# EAGLE design ip_node (EAGLE 5.06)
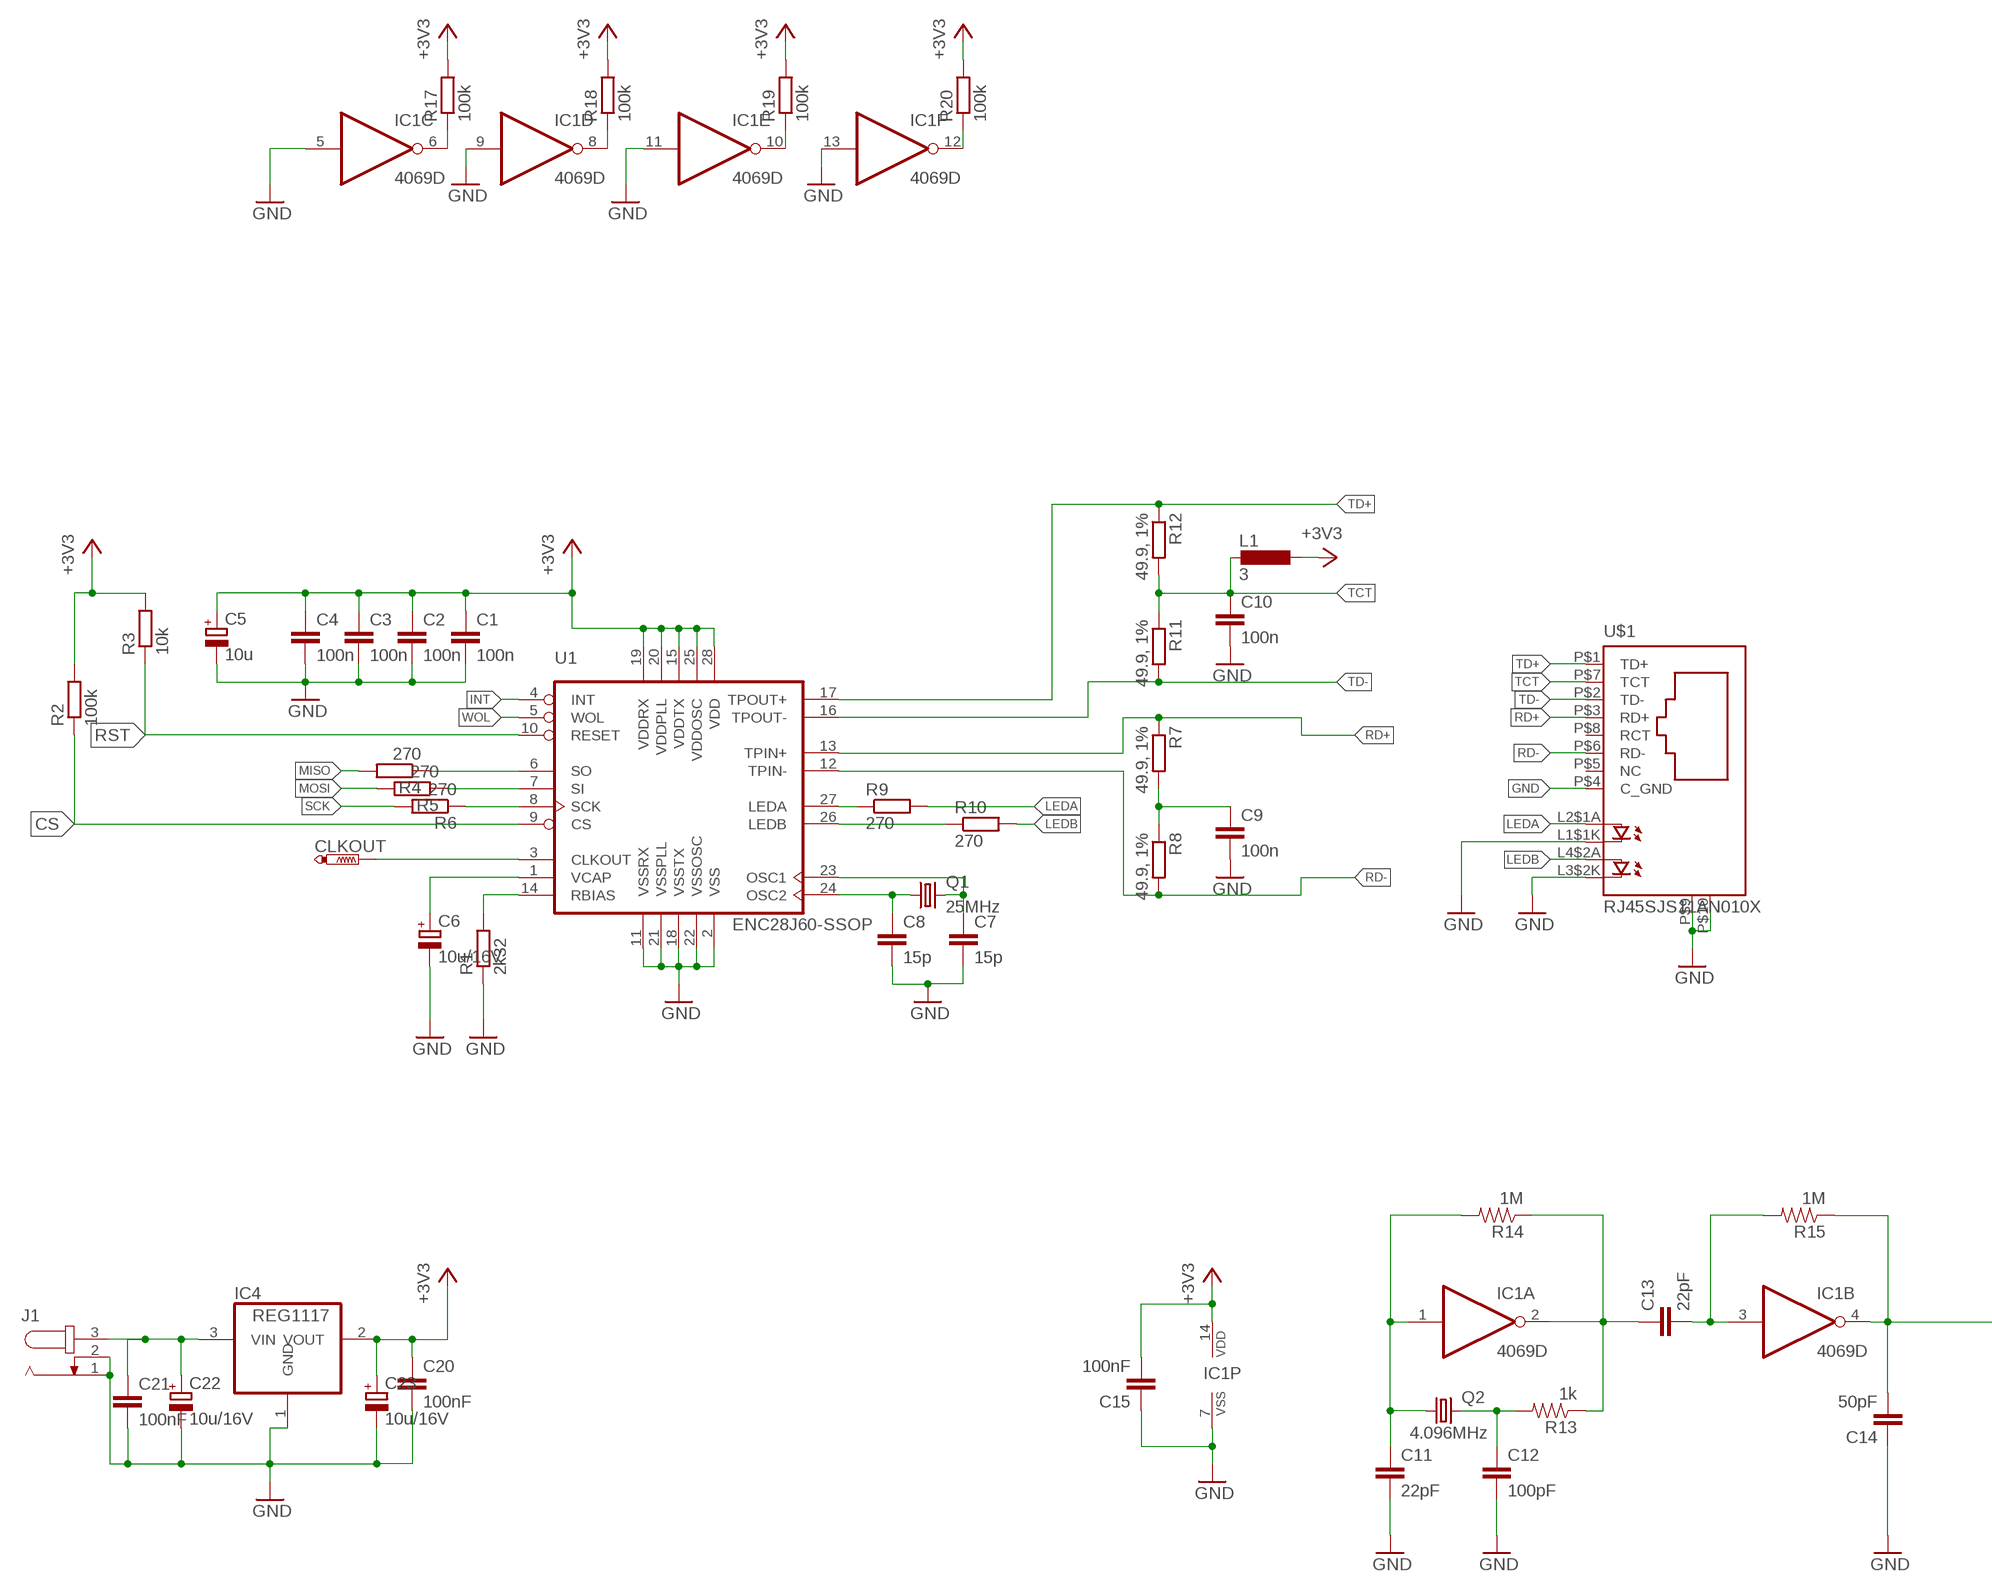
[diagram p0: schematic, sheet 1, part 1 of 2]
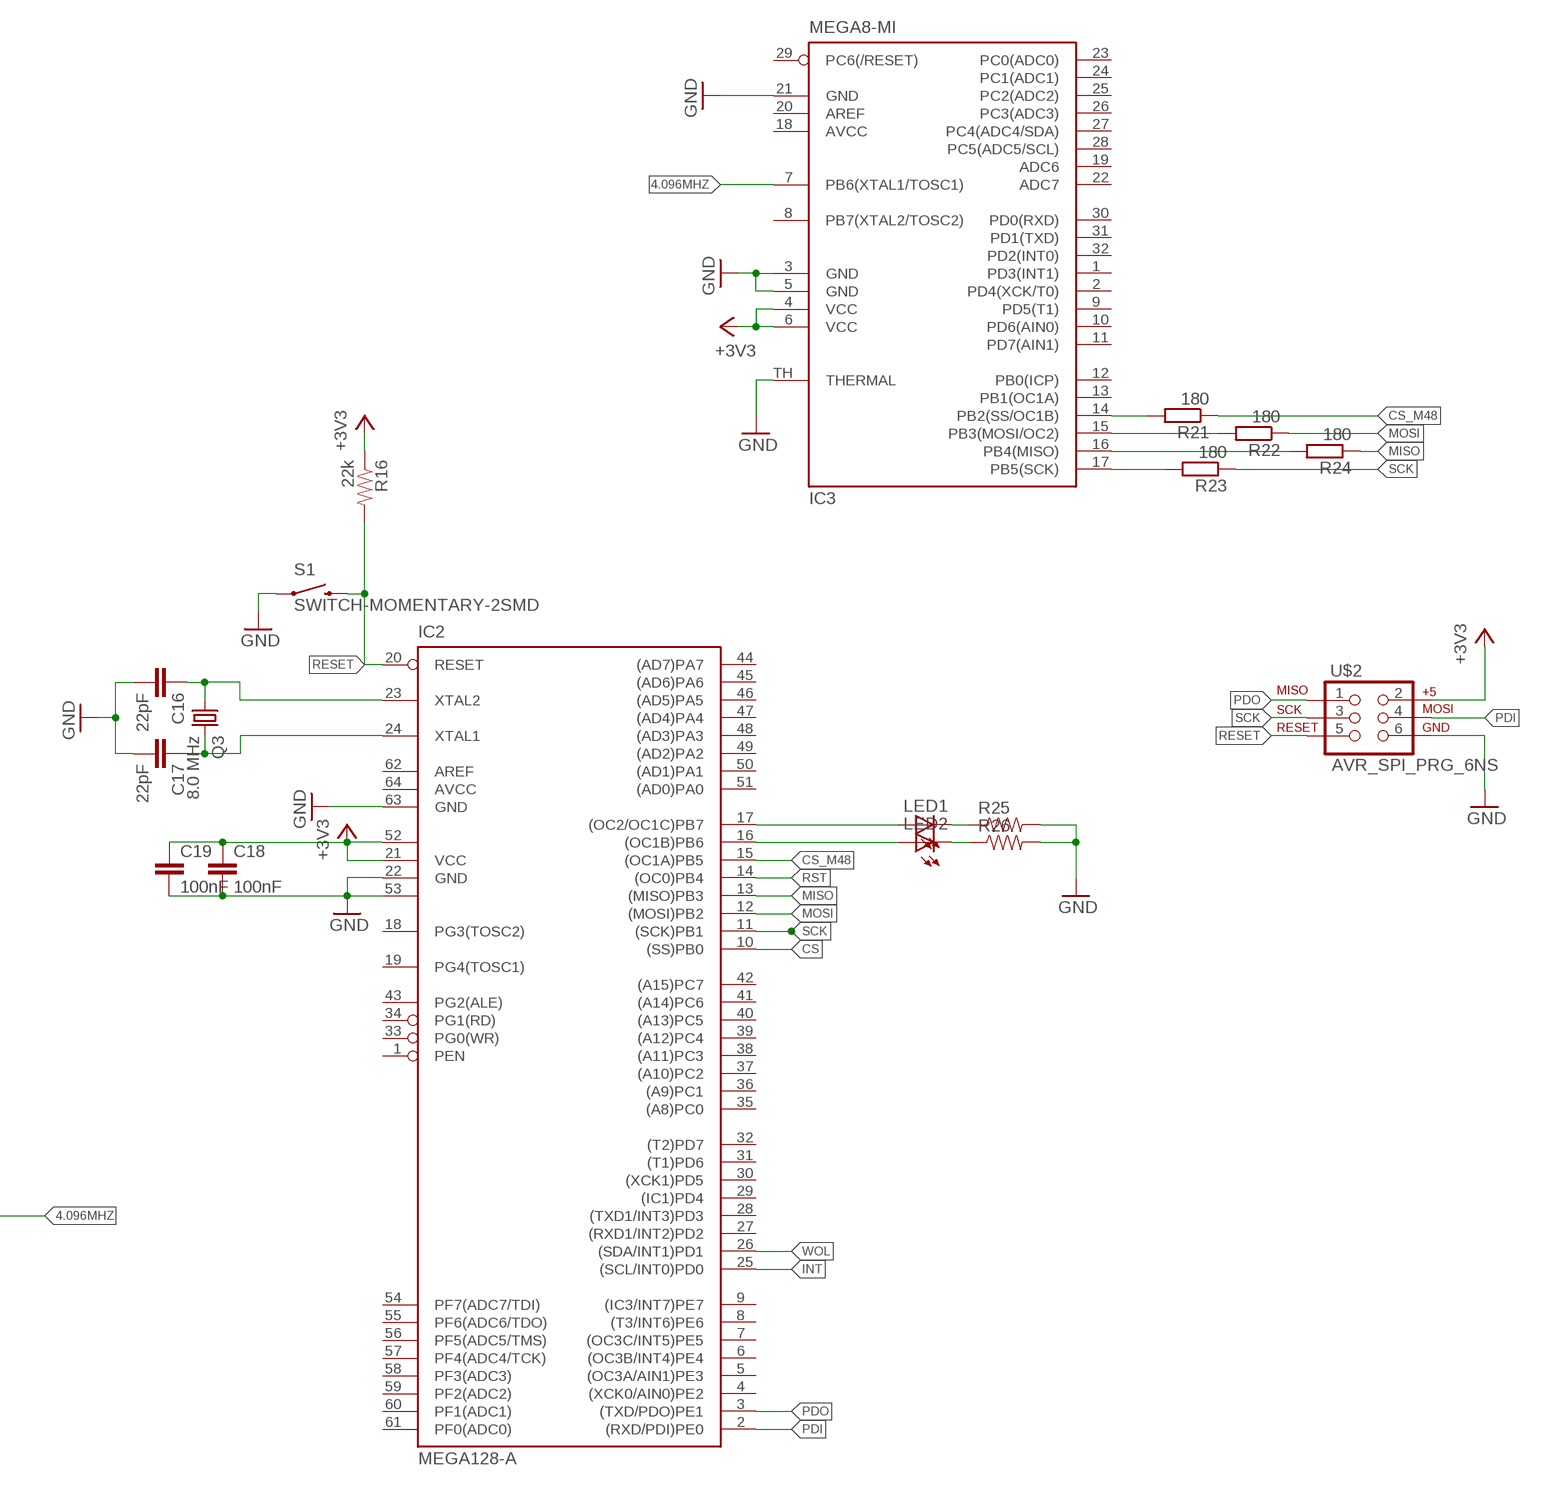
[diagram p1: schematic, sheet 1, part 2 of 2]

## Parts
C1  100n  C-EUC0805  [C0805]
C2  100n  C-EUC0805  [C0805]
C3  100n  C-EUC0805  [C0805]
C4  100n  C-EUC0805  [C0805]
C5  10u  CPOL-EUCT3528  [CT3528]
C6  10u/16V  CPOL-EUCT3528  [CT3528]
C7  15p  C-EUC0805  [C0805]
C8  15p  C-EUC0805  [C0805]
C9  100n  C-EUC0805  [C0805]
C10  100n  C-EUC0805  [C0805]
C11  22pF  CAP0805  [0805]
C12  100pF  CAP0805  [0805]
C13  22pF  CAP0805  [0805]
C14  50pF  CAP0805  [0805]
C15  100nF  CAP0805  [0805]
C16  22pF  CAP0805  [0805]
C17  22pF  CAP0805  [0805]
C18  100nF  CAP0805  [0805]
C19  100nF  CAP0805  [0805]
C20  100nF  CAP0805  [0805]
C21  100nF  CAP0805  [0805]
C22  10u/16V  CPOL-EUCT3528  [CT3528]
C23  10u/16V  CPOL-EUCT3528  [CT3528]
CLKOUT  PTR1B1,27  [B1,27]
IC1  4069D  [SO14]
IC2  MEGA128-A  [TQFP64]
IC3  MEGA8-MI  [MLF32-TH]
IC4  REG1117  [SOT223]
J1  JACK-PLUG0  [SPC4077]
L1  3  L-EU0204/7  [0204/7]
LED1  LED0603  [LED-0603]
LED2  LED0603  [LED-0603]
Q1  25MHz  CRYSTALHC49U70  [HC49U70]
Q2  4.096MHz  CRYSTALHC49UV  [HC49U-V]
Q3  8.0 MHz  CRYSTAL5X3  [CRYSTAL-SMD-5X3]
R1  2k32  R-EU_R0805  [R0805]
R2  100k  R-EU_R0805  [R0805]
R3  10k  R-EU_R0805  [R0805]
R4  270  R-EU_R0805  [R0805]
R5  270  R-EU_R0805  [R0805]
R6  270  R-EU_R0805  [R0805]
R7  49.9, 1%  R-EU_R0805  [R0805]
R8  49.9, 1%  R-EU_R0805  [R0805]
R9  270  R-EU_R0805  [R0805]
R10  270  R-EU_R0805  [R0805]
R11  49.9, 1%  R-EU_R0805  [R0805]
R12  49.9, 1%  R-EU_R0805  [R0805]
R13  1k  RESISTOR  [0805]
R14  1M  RESISTOR  [0805]
R15  1M  RESISTOR  [0805]
R16  22k  RESISTOR  [0805]
R17  100k  R-EU_R0805  [R0805]
R18  100k  R-EU_R0805  [R0805]
R19  100k  R-EU_R0805  [R0805]
R20  100k  R-EU_R0805  [R0805]
R21  180  R-EU_R0805  [R0805]
R22  180  R-EU_R0805  [R0805]
R23  180  R-EU_R0805  [R0805]
R24  180  R-EU_R0805  [R0805]
R25  RESISTOR  [0805]
R26  RESISTOR  [0805]
S1  SWITCH-MOMENTARY-2SMD  [TACTILE_SWITCH_SMD]
U1  ENC28J60-SSOP  [SSOP28]
U$1  RJ45SJS11AN010X  [RJ45SJS11AN010X]
U$2  AVR_SPI_PRG_6NS  [2X3-NS]

## Nets
4.096MHZ: C14.2 IC1.4(B:O) IC3.7(PB6(XTAL1/TOSC1)) R15.1
+3V3: C1.1 C2.1 C3.1 C4.1 C5.+ C15.2 C18.1 C19.1 C20.1 C23.+ IC1.14(P:VDD) IC2.21(VCC) IC2.52(VCC1) IC3.4(VCC) IC3.6(VCC) IC4.2(VOUT) L1.1 R2.2 R3.2 R16.1 R17.2 R18.2 R19.2 R20.2 U1.15(VDDTX) U1.19(VDDRX) U1.20(VDDPLL) U1.25(VDDOSC) U1.28(VDD) U$2.2
CLKOUT: CLKOUT.PP(TP) U1.3(CLKOUT)
CS: IC2.10((SS)PB0) R2.1 U1.9(CS)
CS_M48: IC2.15((OC1A)PB5) R21.1
GND: C1.2 C2.2 C3.2 C4.2 C5.- C6.- C7.2 C8.2 C9.2 C10.2 C11.2 C12.2 C14.1 C15.1 C16.2 C17.2 C18.2 C19.2 C20.2 C21.2 C22.- C23.- IC1.5(C:I) IC1.7(P:VSS) IC1.9(D:I) IC1.11(E:I) IC1.13(F:I) IC2.22(GND) IC2.53(GND1) IC2.63(GND) IC3.3(GND) IC3.5(GND) IC3.21(GND) IC3.TH(THERMAL) IC4.1(GND) J1.1 J1.2 R1.1 R25.2 R26.2 S1.1 U1.2(VSS) U1.11(VSSRX) U1.18(VSSTX) U1.21(VSSPLL) U1.22(VSSOSC) U$1.L1$1K(C) U$1.L3$2K(C1) U$1.P$4(C_GND) U$1.P$9(S1) U$1.P$10(S2) U$2.6
INT: IC2.25((SCL/INT0)PD0) U1.4(INT)
LEDA: R9.2 U$1.L2$1A(A)
LEDB: R10.2 U$1.L4$2A(A1)
MISO: IC2.13((MISO)PB3) R4.2 R24.1
MOSI: IC2.12((MOSI)PB2) R5.2 R22.1
N$1: C11.1 IC1.1(A:I) Q2.1 R14.2
N$2: R6.1 U1.8(SCK)
N$3: R5.1 U1.7(SI)
N$4: R4.1 U1.6(SO)
N$5: C7.1 Q1.2 U1.23(OSC1)
N$6: C8.1 Q1.1 U1.24(OSC2)
N$7: R1.2 U1.14(RBIAS)
N$8: R9.1 U1.27(LEDA)
N$9: R10.1 U1.26(LEDB)
N$10: C12.1 Q2.2 R13.2
N$11: C9.1 R7.2 R8.1
N$12: C13.1 IC1.2(A:O) R13.1 R14.1
N$13: C13.2 IC1.3(B:I) R15.2
N$14: C16.1 IC2.23(XTAL2) Q3.1
N$15: C17.1 IC2.24(XTAL1) Q3.3
N$16: IC1.8(D:O) R18.1
N$17: IC1.10(E:O) R19.1
N$18: IC1.12(F:O) R20.1
N$19: IC1.6(C:O) R17.1
N$20: IC3.17(PB5(SCK)) R23.2
N$21: IC3.16(PB4(MISO)) R24.2
N$22: IC3.15(PB3(MOSI/OC2)) R22.2
N$23: IC3.14(PB2(SS/OC1B)) R21.2
N$24: IC2.17((OC2/OC1C)PB7) LED1.A
N$25: IC2.16((OC1B)PB6) LED2.A
N$26: C21.1 C22.+ IC4.3(VIN) J1.3
N$27: LED1.C R25.1
N$28: LED2.C R26.1
PDI: IC2.2((RXD/PDI)PE0) U$2.4
PDO: IC2.3((TXD/PDO)PE1) U$2.1
RD+: R7.1 U1.13(TPIN+) U$1.P$3(RD+)
RD-: R8.2 U1.12(TPIN-) U$1.P$6(RD-)
RESET: IC2.20(RESET) R16.2 S1.3 U$2.5
RST: IC2.14((OC0)PB4) R3.1 U1.10(RESET)
SCK: IC2.11((SCK)PB1) R6.2 R23.1 U$2.3
TCT: C10.1 L1.2 R11.1 R12.2 U$1.P$7(TCT)
TD+: R12.1 U1.17(TPOUT+) U$1.P$1(TD+)
TD-: R11.2 U1.16(TPOUT-) U$1.P$2(TD-)
VCAP: C6.+ U1.1(VCAP)
WOL: IC2.26((SDA/INT1)PD1) U1.5(WOL)
Unconnected: IC2.1(PEN) IC2.4((XCK0/AIN0)PE2) IC2.5((OC3A/AIN1)PE3) IC2.6((OC3B/INT4)PE4) IC2.7((OC3C/INT5)PE5) IC2.8((T3/INT6)PE6) IC2.9((IC3/INT7)PE7) IC2.18(PG3(TOSC2)) IC2.19(PG4(TOSC1)) IC2.27((RXD1/INT2)PD2) IC2.28((TXD1/INT3)PD3) IC2.29((IC1)PD4) IC2.30((XCK1)PD5) IC2.31((T1)PD6) IC2.32((T2)PD7) IC2.33(PG0(WR)) IC2.34(PG1(RD)) IC2.35((A8)PC0) IC2.36((A9)PC1) IC2.37((A10)PC2) IC2.38((A11)PC3) IC2.39((A12)PC4) IC2.40((A13)PC5) IC2.41((A14)PC6) IC2.42((A15)PC7) IC2.43(PG2(ALE)) IC2.44((AD7)PA7) IC2.45((AD6)PA6) IC2.46((AD5)PA5) IC2.47((AD4)PA4) IC2.48((AD3)PA3) IC2.49((AD2)PA2) IC2.50((AD1)PA1) IC2.51((AD0)PA0) IC2.54(PF7(ADC7/TDI)) IC2.55(PF6(ADC6/TDO)) IC2.56(PF5(ADC5/TMS)) IC2.57(PF4(ADC4/TCK)) IC2.58(PF3(ADC3)) IC2.59(PF2(ADC2)) IC2.60(PF1(ADC1)) IC2.61(PF0(ADC0)) IC2.62(AREF) IC3.1(PD3(INT1)) IC3.2(PD4(XCK/T0)) IC3.8(PB7(XTAL2/TOSC2)) IC3.9(PD5(T1)) IC3.10(PD6(AIN0)) IC3.11(PD7(AIN1)) IC3.12(PB0(ICP)) IC3.13(PB1(OC1A)) IC3.19(ADC6) IC3.20(AREF) IC3.22(ADC7) IC3.23(PC0(ADC0)) IC3.24(PC1(ADC1)) IC3.25(PC2(ADC2)) IC3.26(PC3(ADC3)) IC3.27(PC4(ADC4/SDA)) IC3.28(PC5(ADC5/SCL)) IC3.29(PC6(/RESET)) IC3.30(PD0(RXD)) IC3.31(PD1(TXD)) IC3.32(PD2(INT0)) U$1.P$5(NC) U$1.P$8(RCT)

## Power pins joined to a net without a drawn wire
AVCC: IC2.64(AVCC) IC3.18(AVCC)

## Library data of the parts
C1-C4 C7-C10 = rcl:C-EU: CAPACITOR, European symbol
C5 C6 C22 C23 = rcl:CPOL-EU: POLARIZED CAPACITOR, European symbol
C11-C21 = SparkFun:CAP: Capacitor Standard 0603 ceramic capacitor, and 0.1" leaded capacitor.
CLKOUT = testpad:PTR1: TEST PIN
IC1 = 40xx:4069: Hex INVERTER
IC2 = atmel:MEGA128: MICROCONTROLLER 128 Kbytes FLASH 4 Kbytes SRAM 4 Kbytes EEPROM DUAL USART 8-channel 10 bit ADC Source: avr.lbr
IC3 = atmel:MEGA8-MI: MICROCONTROLLER 8 Kbytes FLASH, 1 kbytes SRAM, 512 bytes EEPROM, USART, 6-channel 10 bit ADC, 2-channel 8 bit ADC Pin compatible with Atmega48, ATMega88, ATMega168 Source: avr.lbr
IC4 = burr-brown:REG1117: 800mA and 1A Low Dropout (LDO) Positive Regulator 1.8V, 2.5V, 2.85V, 3.3V, 5V, and Adj
J1 = con-jack:JACK-PLUG: DC POWER JACK Power Jack, DC, Right Angle, Through Hole, Rated 5A at 16VDC, PC Terminals Distributor: Farnell (www.Farnell.de) Drawing: 84N1161.pdf / 84N1162.pdf Manufacturer: SPC Technology (www.spctechnology.com) Type: SPC4077 / SPC 4078
L1 = rcl:L-EU: INDUCTOR, European symbol
LED1 LED2 = SparkFun:LED: LEDs Standard schematic elements and footprints for 5mm, 3mm, 1206, and 0603 sized LEDs. 5mm - Spark Fun Electronics SKU : COM-00529 (and others)
Q1 = crystal:CRYSTAL: CRYSTAL
Q2 Q3 = SparkFun:CRYSTAL: Crystals Various standard crystals. Proven footprints. Spark Fun Electronics SKU : COM-00534
R1-R12 R17-R24 = rcl:R-EU_: RESISTOR, European symbol
R13-R16 R25 R26 = SparkFun:RESISTOR: Resistor Basic schematic elements and footprints for 0603, 1206, and PTH 1/10th watt (small) resistors.
S1 = SparkFun:SWITCH-MOMENTARY-2
U1 = microchip-enc28j60:ENC28J60-*: Microchip 10Mbit Eth. contoller with SPI interface
U$1 = rj45:RJ45SJS11AN010X
U$2 = SparkFun:AVR_SPI_PRG_6: AVR ISP 6 Pin This is the reduced ISP connector for AVR programming. Common on Arduino. This footprint will take up less PCB space and can be used with a 10-pin to 6-pin adapter such as SKU: BOB-08508

## Board
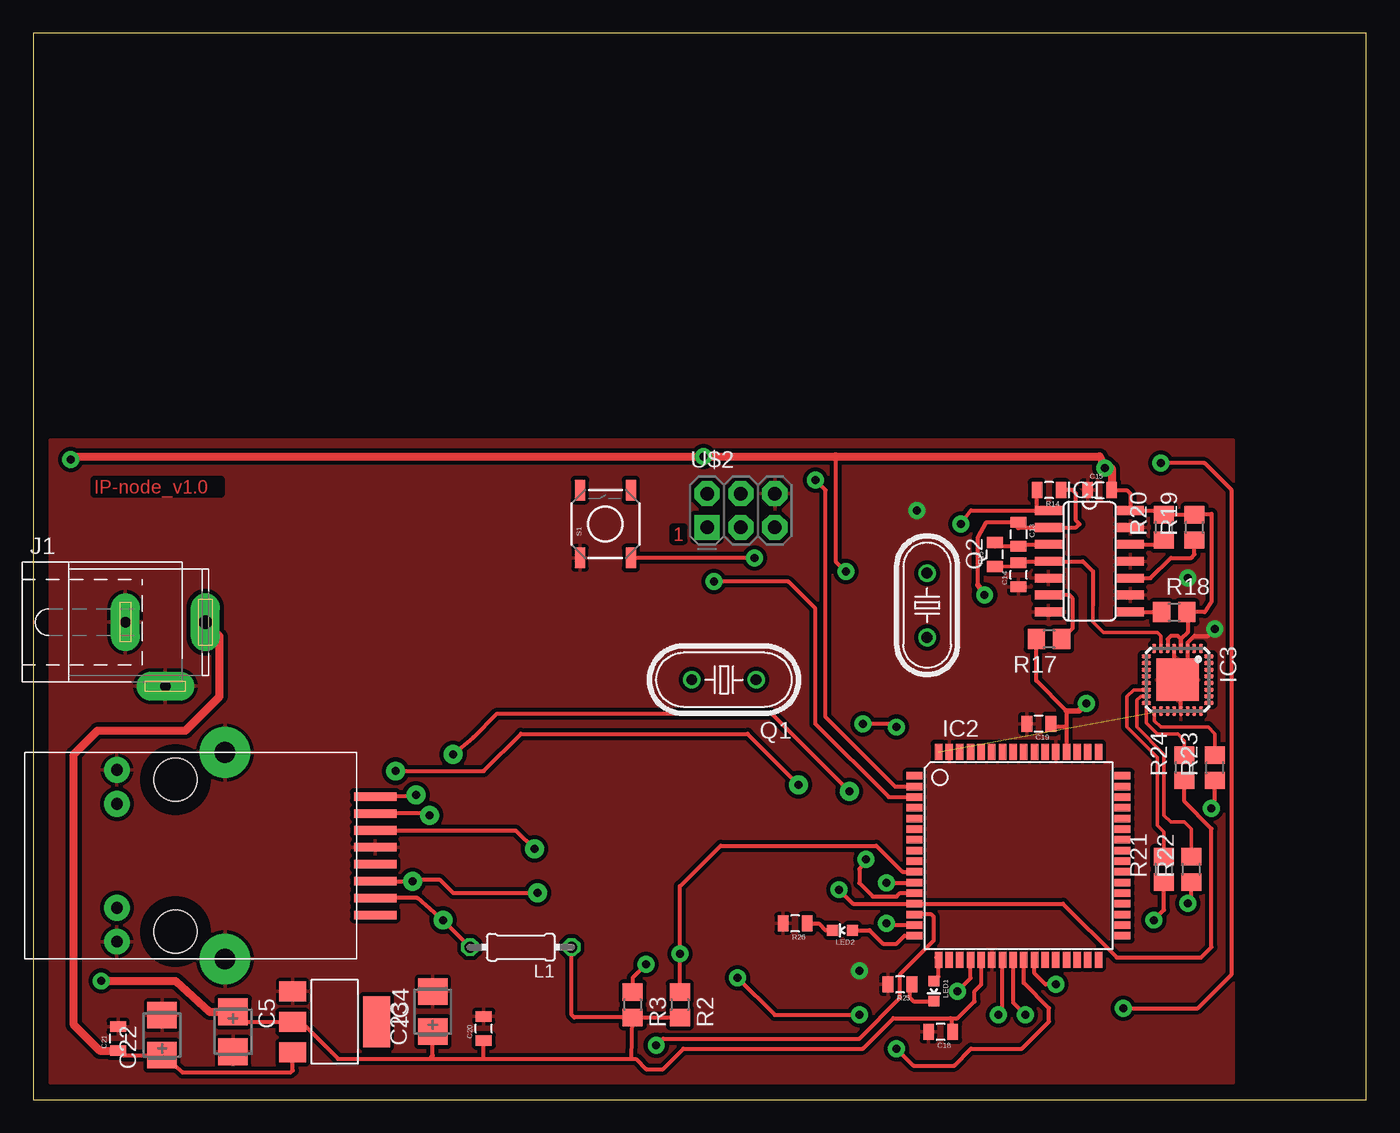
[diagram p2: board, top side]
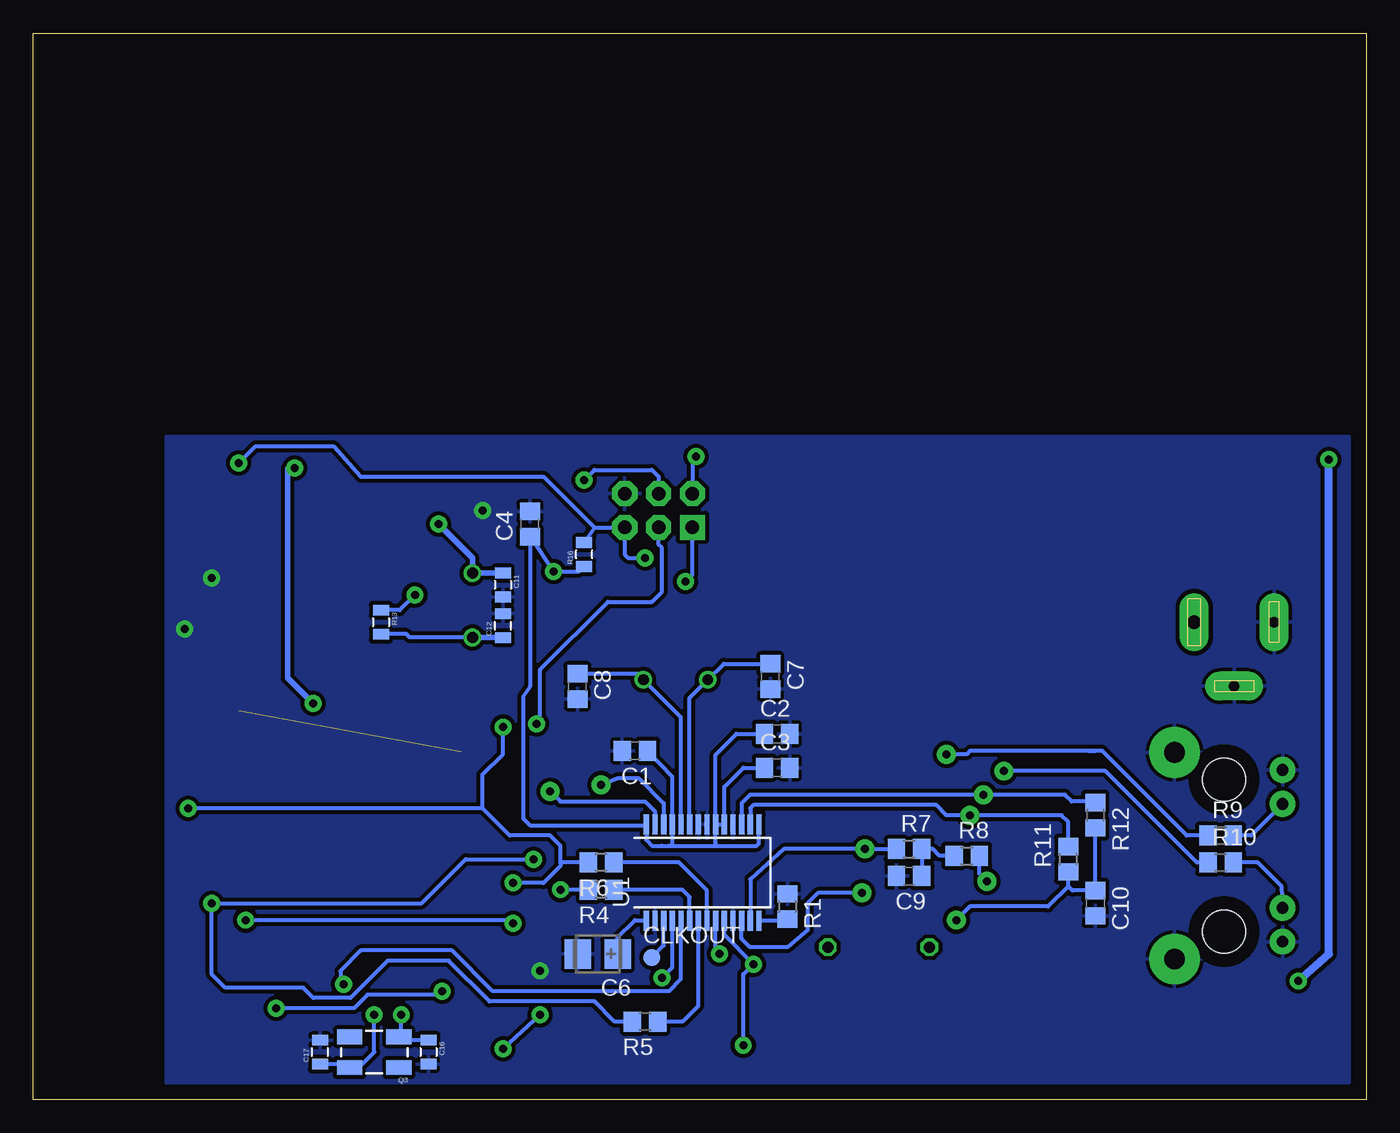
[diagram p3: board, bottom side, seen from below]

Size 100 x 80 mm. Coordinates in mm from the lower left corner, seen from the top.
Outline: 0,0 100,0 100,80 0,80 0,0
Copper layers (1*16): Top 0.035mm / dielectric 1.5mm / Bottom 0.035mm
Design rules "default *": minimum track width 10mil, minimum drill 0.6mm, track to track 8mil, track to pad 8mil, pad to pad 8mil, via to via 8mil, smd to smd 8mil, copper to edge 40mil, drill to drill 8mil, minimum pad ring 10mil, minimum via ring 8mil, stop-mask expansion 4mil, vias tented up to drill 0mil, thermal gap 10mil

### Footprints (pad centres in the part's own frame; a part is rotated, then mirrored left to right if it is on the bottom)
C0805 = smd 1.3 x 1.5: 1 -0.95,0; 2 0.95,0
CT3528 = smd 2 x 2.2: + -1.5,0; - 1.5,0
0805 = smd 0.8 x 1.2: 1 -0.9,0; 2 0.9,0
B1,27 = smd 1.27 x 1.27: PP 0,0
SO14 = smd 0.66 x 2.032: 1 -3.81,-3.073; 2 -2.54,-3.073; 3 -1.27,-3.073; 4 0,-3.073; 5 1.27,-3.073; 6 2.54,-3.073; 7 3.81,-3.073; 8 3.81,3.073; 9 2.54,3.073; 10 1.27,3.073; 11 0,3.073; 12 -1.27,3.073; 13 -2.54,3.073; 14 -3.81,3.073
TQFP64 = smd 1.194 x 0.559: 1 -7.8,6; 2 -7.8,5.2; 3 -7.8,4.4; 4 -7.8,3.6; 5 -7.8,2.8; 6 -7.8,2; 7 -7.8,1.2; 8 -7.8,0.4; 9 -7.8,-0.4; 10 -7.8,-1.2; 11 -7.8,-2; 12 -7.8,-2.8; 13 -7.8,-3.6; 14 -7.8,-4.4; 15 -7.8,-5.2; 16 -7.8,-6; 33 7.8,-6; 34 7.8,-5.2; 35 7.8,-4.4; 36 7.8,-3.6; 37 7.8,-2.8; 38 7.8,-2; 39 7.8,-1.2; 40 7.8,-0.4; 41 7.8,0.4; 42 7.8,1.2; 43 7.8,2; 44 7.8,2.8; 45 7.8,3.6; 46 7.8,4.4; 47 7.8,5.2; 48 7.8,6 | smd 0.559 x 1.194: 17 -6,-7.8; 18 -5.2,-7.8; 19 -4.4,-7.8; 20 -3.6,-7.8; 21 -2.8,-7.8; 22 -2,-7.8; 23 -1.2,-7.8; 24 -0.4,-7.8; 25 0.4,-7.8; 26 1.2,-7.8; 27 2,-7.8; 28 2.8,-7.8; 29 3.6,-7.8; 30 4.4,-7.8; 31 5.2,-7.8; 32 6,-7.8; 49 6,7.8; 50 5.2,7.8; 51 4.4,7.8; 52 3.6,7.8; 53 2.8,7.8; 54 2,7.8; 55 1.2,7.8; 56 0.4,7.8; 57 -0.4,7.8; 58 -1.2,7.8; 59 -2,7.8; 60 -2.8,7.8; 61 -3.6,7.8; 62 -4.4,7.8; 63 -5.2,7.8; 64 -6,7.8
MLF32-TH = smd 0.7 x 0.3: 1 -2.35,1.75; 2 -2.35,1.25; 3 -2.35,0.75; 4 -2.35,0.25; 5 -2.35,-0.25; 6 -2.35,-0.75; 7 -2.35,-1.25; 8 -2.35,-1.75; 17 2.35,-1.75; 18 2.35,-1.25; 19 2.35,-0.75; 20 2.35,-0.25; 21 2.35,0.25; 22 2.35,0.75; 23 2.35,1.25; 24 2.35,1.75 | smd 0.3 x 0.7: 9 -1.75,-2.35; 10 -1.25,-2.35; 11 -0.75,-2.35; 12 -0.25,-2.35; 13 0.25,-2.35; 14 0.75,-2.35; 15 1.25,-2.35; 16 1.75,-2.35; 25 1.75,2.35; 26 1.25,2.35; 27 0.75,2.35; 28 0.25,2.35; 29 -0.25,2.35; 30 -0.75,2.35; 31 -1.25,2.35; 32 -1.75,2.35 | smd 3.2 x 3.2: TH 0,0
SOT223 = smd 1.499 x 2.007: 1 -2.261,-3.15; 2 0.025,-3.15; 3 2.311,-3.15 | smd 3.81 x 2.007: 4 0,3.15
SPC4077 = drill 0.8 pad 2.184 long: 1 -3,0; 2 0,-4.8 | drill 1 pad 2.184 long: 3 3,0
0204/7 = drill 0.813 octagon: 1 -3.81,0; 2 3.81,0
LED-0603 = smd 0.8 x 0.8: A 0,-0.75; C 0,0.75
HC49U70 = drill 0.813 round: 1 -2.413,0; 2 2.413,0
HC49U-V = drill 0.813 round: 1 -2.413,0; 2 2.413,0
CRYSTAL-SMD-5X3 = smd 1.9 x 1.1: 1 -1.85,-1.15; 2 1.85,-1.15; 3 1.85,1.15; 4 -1.85,1.15
R0805 = smd 1.3 x 1.5: 1 -0.95,0; 2 0.95,0
TACTILE_SWITCH_SMD = smd 1.524 x 0.762: 1 -2.54,1.905; 2 2.54,1.905; 3 -2.54,-1.905; 4 2.54,-1.905
SSOP28 = smd 0.4 x 1.5: 1 -4.225,-3.625; 2 -3.575,-3.625; 3 -2.925,-3.625; 4 -2.275,-3.625; 5 -1.625,-3.625; 6 -0.975,-3.625; 7 -0.325,-3.625; 8 0.325,-3.625; 9 0.975,-3.625; 10 1.625,-3.625; 11 2.275,-3.625; 12 2.925,-3.625; 13 3.575,-3.625; 14 4.225,-3.625; 15 4.225,3.625; 16 3.575,3.625; 17 2.925,3.625; 18 2.275,3.625; 19 1.625,3.625; 20 0.975,3.625; 21 0.325,3.625; 22 -0.325,3.625; 23 -0.975,3.625; 24 -1.625,3.625; 25 -2.275,3.625; 26 -2.925,3.625; 27 -3.575,3.625; 28 -4.225,3.625
RJ45SJS11AN010X = drill 0.89 pad 1.93 round: L1$1K 6.44,19.38; L2$1A 3.9,19.38; L3$2K -6.44,19.38; L4$2A -3.9,19.38 | smd 0.64 x 3.18: P$1 4.445,0; P$2 3.175,0; P$3 1.905,0; P$4 0.635,0; P$5 -0.635,0; P$6 -1.905,0; P$7 -3.175,0; P$8 -4.445,0 | drill 1.57 pad 3.81 round: P$9 -7.75,11.278; P$10 7.75,11.278 | hole 3.25: -5.7,14.988; 5.7,14.988
2X3-NS = drill 1.016 pad 1.88 square: 1 -2.54,-1.27 | drill 1.016 pad 1.88 octagon: 2 -2.54,1.27; 3 0,-1.27; 4 0,1.27; 5 2.54,-1.27; 6 2.54,1.27

### Placement (x,y rotation side)
C1  54.86,26.16 180 bottom
C2  44.2,27.43 0 bottom
C3  44.2,24.89 0 bottom
C4  62.74,43.18 90 bottom
C5  14.99,5.08 270 top
C6  57.66,10.92 180 bottom
C7  44.7,31.75 270 bottom
C8  59.18,30.99 270 bottom
C9  34.29,16.76 180 bottom
C10  20.32,14.73 270 bottom
C11  64.77,38.61 270 bottom
C12  64.77,35.56 90 bottom
C13  73.91,42.42 270 top
C14  73.91,39.37 90 top
C15  80.01,45.72 0 top
C16  70.36,3.56 270 bottom
C17  78.49,3.56 90 bottom
C18  68.07,5.08 180 top
C19  75.44,28.19 180 top
C20  33.78,5.33 90 top
C21  6.35,4.57 90 top
C22  9.65,4.83 90 top
C23  29.97,6.6 90 top
CLKOUT  53.59,10.67 0 bottom
IC1  79.25,40.39 270 top
IC2  73.91,18.29 0 top
IC3  85.85,31.5 270 top
IC4  22.61,5.84 270 top
J1  9.91,35.81 0 top
L1  36.58,11.43 180 top
LED1  67.56,8.13 180 top
LED2  60.71,12.7 90 top
Q1  51.82,31.5 180 top
Q2  67.06,37.08 270 top
Q3  74.42,3.56 180 bottom
R1  43.43,14.48 270 bottom
R2  48.51,7.11 270 top
R3  44.96,7.11 270 top
R4  57.4,15.75 180 bottom
R5  54.1,5.84 180 bottom
R6  57.4,17.78 180 bottom
R7  34.29,18.8 0 bottom
R8  29.97,18.29 0 bottom
R9  10.92,19.81 0 bottom
R10  10.92,17.78 0 bottom
R11  22.35,18.03 90 bottom
R12  20.32,21.34 270 bottom
R13  73.91,35.81 270 bottom
R14  76.2,45.72 180 top
R15  72.14,40.89 90 top
R16  58.67,40.89 90 bottom
R17  76.2,34.54 180 top
R18  85.6,36.58 0 top
R19  87.12,42.93 90 top
R20  84.84,42.93 90 top
R21  84.84,17.27 90 top
R22  86.87,17.27 90 top
R23  88.65,24.89 90 top
R24  86.36,24.89 90 top
R25  65.02,8.64 180 top
R26  57.15,13.21 180 top
S1  42.93,43.18 90 top
U1  49.78,17.02 0 bottom
U$1  25.65,18.29 90 top
U$2  53.09,44.2 0 top

### Tracks (layer width: path | path; a pad name or v marks a point on that pad's centre or on a via)
4.096MHZ
  Top 0.254: 79.5,37.08 79.5,35.81 80.26,35.05 84.33,35.05 | 84.33,35.05 84.58,34.8 | IC3.7 84.6,34.78 84.33,35.05
  Top 0.305: R15.1 73.68,40.02 C14.2 74.28,40.39 IC1.4 78.74,40.39 79.5,39.62 79.5,37.08
+3V3  (via drill 0.6 pad 1.27)
  Top 0.305: C15.2 82.04,45.72 82.3,45.47 82.3,44.22 | 29.72,3.05 22.86,3.05 20.09,5.82 IC4.2 14.48,5.82 C5.+ | 29.72,3.05 33.78,3.05 | 33.78,3.05 44.89,3.05 | 44.89,3.05 45.21,3.05 45.97,2.29 47.24,2.29 48.77,3.81 62.23,3.81 64.52,6.1 68.83,6.1 | 44.89,3.05 R3.2 | IC1.14 84.77,44.2 R20.2 R19.2 87.19,43.94 88.39,43.94 88.39,37.34 87.88,36.58 R18.2 86.61,36.51 86.61,35.05 86.1,34.54 IC3.4 86.1,34.55 85.85,34.8 85.34,34.8 85.1,34.56 IC3.6 | R17.2 75.25,31.43 77.51,29.17 77.51,27.94 | 77.51,27.94 IC2.52 | R3.2 R2.2 | R3.2 40.57,6.16 40.39,6.35 L1.1 | IC2.21 71.11,8.63 70.61,8.13 70.61,7.37 69.34,6.1 68.83,6.1 | v60.96,39.62 60.2,40.39 60.2,48.26 | C19.1 76.59,27.94 77.51,27.94 | 68.83,6.1 C18.1 | C23.+ 29.97,3.3 29.72,3.05 | 33.78,3.05 C20.1
  Top 0.406: 82.3,44.22 IC1.14 | 77.51,29.17 78.44,29.17 v78.99,29.72
  Top 0.61: C15.2 80.91,47.36 v80.39,47.37 80.01,48.26 60.2,48.26 v50.29,48.26 3.05,48.26 v2.79,48.01 | C5.+ 13.23,6.58 10.67,8.89 v5.08,8.89
  Bottom 0.305: U1.20 U1.19 48.16,23.47 46.74,24.89 C3.1 | U1.15 45.56,19.21 45.72,19.05 48.77,19.05 | C1.1 52.06,24.21 U1.25 52.06,19.06 52.07,19.05 | 52.83,19.05 52.3,19.05 | 52.83,19.05 53.59,19.05 54.01,19.46 U1.28 54.01,20.57 62.74,20.57 63.25,21.08 63.25,30.23 62.74,30.99 C4.1 62.67,42.16 v60.96,39.62 59.04,39.62 R16.1 | U1.20 48.81,19.26 48.77,19.05 | 52.07,19.05 48.77,19.05 | 52.83,19.05 52.07,19.05 | U$2.2 50.55,48.01 v50.29,48.26 | C2.1 47.24,27.43 48.81,25.87 U1.20
  Bottom 0.406: v78.99,29.72 80.91,31.63 C15.2 80.91,47.36 v80.39,47.37
  Bottom 0.61: v5.08,8.89 2.79,10.92 v2.79,48.01
AVCC  (1 unrouted)
CLKOUT
  Bottom 0.305: U1.3 52.71,11.55 CLKOUT.PP
CS  (via drill 0.6 pad 1.27)
  Top 0.305: IC2.10 65.21,17.09 63.25,19.05 51.56,19.05 48.51,16 v48.51,10.92 R2.1
  Bottom 0.305: U1.9 48.81,11.22 v48.51,10.92
CS_M48  (via drill 0.6 pad 1.27)
  Top 0.305: R21.1 84.84,14.22 v84.07,13.46 | v64.01,13.21 64.13,13.09 IC2.15
  Bottom 0.305: v84.07,13.46 64.26,13.46 v64.01,13.21
GND  (via drill 0.6 pad 1.27)
  Top 0.305: v88.65,35.31 88.14,34.8 87.12,34.8 86.6,34.28 IC3.3 86.6,32.25 IC3.TH | IC3.5 85.6,31.75 IC3.TH | IC3.21 86.1,31.25 IC3.TH
  other vias: 66.29,44.2 86.61,39.12 61.98,9.65
  pour Top (isolate 0.305): 1.27,49.49 90.03,49.49 90.03,1.27 1.27,1.27
  pour Bottom (isolate 0.305): 1.27,49.74 90.03,49.74 90.03,1.27 1.27,1.27
INT  (via drill 0.6 pad 1.27)
  Top 0.305: IC2.25 74.31,8.74 76.2,6.86 76.2,5.84 74.17,3.81 70.36,3.81 69.09,2.54 66.04,2.54 v64.77,3.81 | v61.98,6.35 55.63,6.35 v52.83,9.14
  Bottom 0.305: v61.98,6.35 v64.77,3.81 | v52.83,9.14 52.06,9.92 U1.4
LEDA
  Bottom 0.305: U$1.L2$1A 8.64,19.81 R9.2
LEDB
  Bottom 0.305: U$1.L4$2A 6.35,15.99 8.14,17.78 R10.2
MISO  (via drill 0.6 pad 1.27)
  Top 0.305: v60.45,15.75 61.51,14.69 IC2.13 77.26,14.69 81.28,10.67 87.63,10.67 88.39,11.43 88.39,20.32 86.36,22.35 R24.1
  Bottom 0.305: R4.2 v60.45,15.75
MOSI  (via drill 0.6 pad 1.27)
  Top 0.305: R22.1 86.87,14.99 v86.61,14.73 | v62.48,18.03 61.98,17.27 61.98,16.26 62.99,15.24 64.77,15.24 65.02,15.49 IC2.12
  Bottom 0.305: v62.48,18.03 67.56,18.03 70.87,14.73 v86.61,14.73 86.61,9.4 85.6,8.38 79.76,8.38 78.99,7.62 76.2,7.62 73.41,10.41 68.83,10.41 65.79,7.37 57.91,7.37 56.39,5.84 R5.2
N$1  (via drill 0.6 pad 1.27)
  Top 0.305: R14.2 75.3,44.2 70.36,44.2 v69.6,43.18
  Top 0.406: 75.3,44.2 IC1.1
  Bottom 0.406: C11.1 64.78,39.5 Q2.1 67.06,40.64 v69.6,43.18
N$2
  Bottom 0.305: R6.1 51.56,17.78 49.46,15.68 U1.8
N$3
  Bottom 0.305: R5.1 51.31,5.84 50.1,7.05 50.1,8.38 50.11,8.39 U1.7
N$4
  Bottom 0.305: U1.6 50.76,15.2 51.31,15.75 R4.1
N$5
  Bottom 0.305: U1.23 50.76,30.14 Q1.2 48.2,32.7 C7.1
N$6
  Bottom 0.305: U1.24 51.41,28.68 Q1.1 54.67,31.94 C8.1
N$7
  Bottom 0.305: 45.56,13.21 U1.14 43.57,13.39 R1.2
N$8  (via drill 0.6 pad 1.42)
  Top 0.305: v61.21,23.11 55.37,28.96 34.8,28.96 33.02,27.18 v31.5,25.91
  Bottom 0.305: U1.27 53.36,21.61 54.1,22.35 60.45,22.35 v61.21,23.11 | R9.1 13.46,19.81 19.81,26.16 20.83,26.16 | 20.83,26.16 20.32,26.16 | 20.83,26.16 29.72,26.16 29.97,25.91 v31.5,25.91
N$9  (via drill 0.6 pad 1.42)
  Top 0.305: v57.4,23.62 53.59,27.43 36.58,27.43 33.78,24.64 v27.18,24.64
  Bottom 0.305: U1.26 52.71,22.23 54.61,24.13 56.13,24.13 v57.4,23.62 | v27.18,24.64 19.56,24.64 12.7,17.78 R10.1
N$10
  Bottom 0.305: 67.18,34.54 Q2.2 71.75,34.67 72,34.91 R13.2
  Bottom 0.406: Q2.2 64.78,34.67 C12.1
N$11
  Bottom 0.305: C9.1 R7.2 32.51,18.8 32,18.29 R8.1
N$12  (via drill 0.6 pad 1.27)
  Top 0.305: 70.87,38.61 70.87,42.16 71.51,43.32 C13.1 | 73.91,42.93 IC1.2 78.23,42.93 78.49,43.18 78.23,43.43 78.23,45.47 77.98,45.72 R14.1
  Top 0.406: v71.37,37.85 70.87,38.61 | C13.1 73.91,42.93
  Bottom 0.305: v71.37,37.85 72.51,36.71 R13.1
N$13
  Top 0.305: 72.14,41.52 C13.2 74.31,41.66 IC1.3
  Top 0.406: R15.2 72.14,41.52
N$14  (via drill 0.6 pad 1.27)
  Top 0.305: IC2.23 72.71,6.67 v72.39,6.35
  Bottom 0.305: C16.1 72.32,4.46 Q3.1 72.39,4.89 v72.39,6.35
N$15  (via drill 0.6 pad 1.27)
  Top 0.305: IC2.24 73.51,7.26 v74.42,6.35
  Bottom 0.305: C17.1 76.52,2.66 Q3.3 76.15,2.29 75.69,2.29 74.42,3.56 v74.42,6.35
N$16
  Top 0.305: IC1.8 R18.1
N$17
  Top 0.305: R19.1 87.12,40.89 86.87,40.64 85.34,40.64 83.82,39.12 IC1.10
N$18
  Top 0.305: IC1.12 84.77,41.66 R20.1
N$19
  Top 0.305: IC1.6 77.72,37.85 77.98,37.59 77.98,35.37 R17.1
N$20
  Top 0.254: IC3.17 84.1,28.42 84.58,27.94 88.14,27.94 88.65,27.43 R23.2
N$21
  Top 0.254: IC3.16 83.5,28.26 84.33,27.43 85.85,27.43 86.36,26.92 R24.2
N$22
  Top 0.254: IC3.15 83.08,30.25 82.8,29.97 82.8,27.94 84.84,25.91 84.84,21.34 85.34,20.83 86.36,20.83 86.87,20.32 R22.2
N$23
  Top 0.254: IC3.14 82.56,30.75 82.04,30.23 82.04,27.94 84.33,25.65 84.33,20.57 84.84,20.07 R21.2
N$24
  Top 0.305: 67.73,10.67 IC2.17 67.91,9.23 LED1.A
N$25
  Top 0.305: IC2.16 65.37,12.29 64.77,11.68 63.75,11.68 62.74,12.7 LED2.A
N$26
  Top 0.305: IC4.3 19.46,2.18 19.3,2.03 11.2,2.03 C22.+ 6.7,3.33 C21.1
  Top 0.61: J1.3 13.97,34.75 13.97,30.23 11.43,27.69 4.83,27.69 3.05,25.91 3.05,5.59 4.96,3.67 C21.1
N$27
  Top 0.305: LED1.C 66.03,7.38 65.79,7.62 65.79,8.5 R25.1
N$28
  Top 0.305: LED2.C 59.44,12.7 58.93,13.21 R26.1
PDI  (via drill 0.6 pad 1.27)
  Top 0.305: IC2.2 64.65,23.49 59.44,28.7 59.44,45.72 v58.67,46.48
  Bottom 0.305: v58.67,46.48 57.91,47.24 53.59,47.24 53.09,46.74 U$2.4
PDO  (via drill 0.6 pad 1.27)
  Top 0.305: v51.05,38.86 56.64,38.86 58.67,36.83 58.67,28.19 64.18,22.69 IC2.3
  Bottom 0.305: U$2.1 50.55,39.37 v51.05,38.86
RD+  (via drill 0.6 pad 1.42)
  Top 0.305: U$1.P$3 36.2,20.19 v37.59,18.8
  Bottom 0.305: U1.13 46.21,16.53 43.69,18.8 v37.59,18.8 R7.1
RD-  (via drill 0.6 pad 1.42)
  Top 0.305: v37.85,15.49 31.5,15.49 30.48,16.51 28.7,16.51 28.57,16.38 v28.45,16.38 U$1.P$6
  Bottom 0.305: U1.12 46.86,12.06 46.23,11.43 43.43,11.43 41.91,12.7 41.91,14.73 41.15,15.49 v37.85,15.49 | R8.2 29.02,16.96 v28.45,16.38
RESET  (via drill 0.6 pad 1.27)
  Top 0.305: IC2.20 70.31,9.1 v69.34,8.13 | v81.79,6.86 87.38,6.86 89.92,9.4 89.92,45.72 87.88,47.75 v84.58,47.75 | v54.1,40.64 S1.3
  Bottom 0.305: v69.34,8.13 69.6,7.87 74.93,7.87 75.95,6.86 v81.79,6.86 | 57.91,42.93 61.72,46.74 75.44,46.74 77.47,49.02 83.31,49.02 v84.58,47.75 | 57.91,42.93 U$2.5 55.63,40.89 55.37,40.64 v54.1,40.64 | 57.91,42.93 R16.2
RST  (via drill 0.6 pad 1.27)
  Top 0.305: v45.97,10.16 44.96,9.14 R3.1 | v46.74,4.06 47.24,4.57 61.98,4.57 65.02,7.62 65.02,9.4 67.56,11.94 67.56,13.72 67.39,13.89 IC2.14
  Bottom 0.305: U1.10 48.16,12.35 v45.97,10.16 46.74,9.4 v46.74,4.06
SCK  (via drill 0.6 pad 1.27)
  Top 0.305: R23.1 88.65,22.1 v88.39,21.84 | v64.01,16.26 66.08,16.26 IC2.11 | v62.23,28.19 64.52,28.19 v64.77,27.94
  Bottom 0.305: 66.29,21.84 v88.39,21.84 | 66.29,21.84 64.26,19.81 61.21,19.81 60.45,19.05 60.45,17.78 | 60.45,17.78 60.45,17.53 61.72,16.26 v64.01,16.26 | R6.2 60.45,17.78 | v62.23,28.19 61.98,28.45 61.98,32.26 56.9,37.34 53.59,37.34 52.83,38.1 52.83,41.4 53.09,41.66 U$2.3 | v64.77,27.94 64.77,25.91 66.29,24.38 66.29,21.84
TCT  (via drill 0.6 pad 1.42)
  Top 0.305: U$1.P$7 28.83,15.11 v30.73,13.46 L1.2
  Bottom 0.305: R12.2 C10.1 22.03,15.68 22.35,16 | v30.73,13.46 29.72,14.48 23.88,14.48 22.35,16 | 22.35,16 R11.1
TD+  (via drill 0.6 pad 1.42)
  Top 0.305: U$1.P$1 28.57,22.73 v28.7,22.86
  Bottom 0.305: U1.17 46.86,22.23 46.23,22.86 v28.7,22.86 22.61,22.86 22.1,22.35 20.39,22.35 R12.1
TD-  (via drill 0.6 pad 1.42)
  Top 0.305: U$1.P$2 29.59,21.46 v29.72,21.34
  Bottom 0.305: U1.16 46.21,21.86 45.97,22.1 32.26,22.1 31.5,21.34 v29.72,21.34 | v29.72,21.34 29.59,21.46 | R11.2 22.35,20.83 22.86,21.34 v29.72,21.34
VCAP
  Bottom 0.305: U1.1 54.08,13.46 54.86,13.46 56.16,12.17 C6.+
WOL  (via drill 0.6 pad 1.27)
  Top 0.305: v76.71,8.64 75.95,8.64 75.11,9.47 IC2.26
  Bottom 0.305: U1.5 51.41,9.04 52.32,8.13 65.53,8.13 68.58,11.18 75.44,11.18 76.96,9.65 76.96,8.89 v76.71,8.64

### Text on the board
Top: IP-node_v1.0 | 1